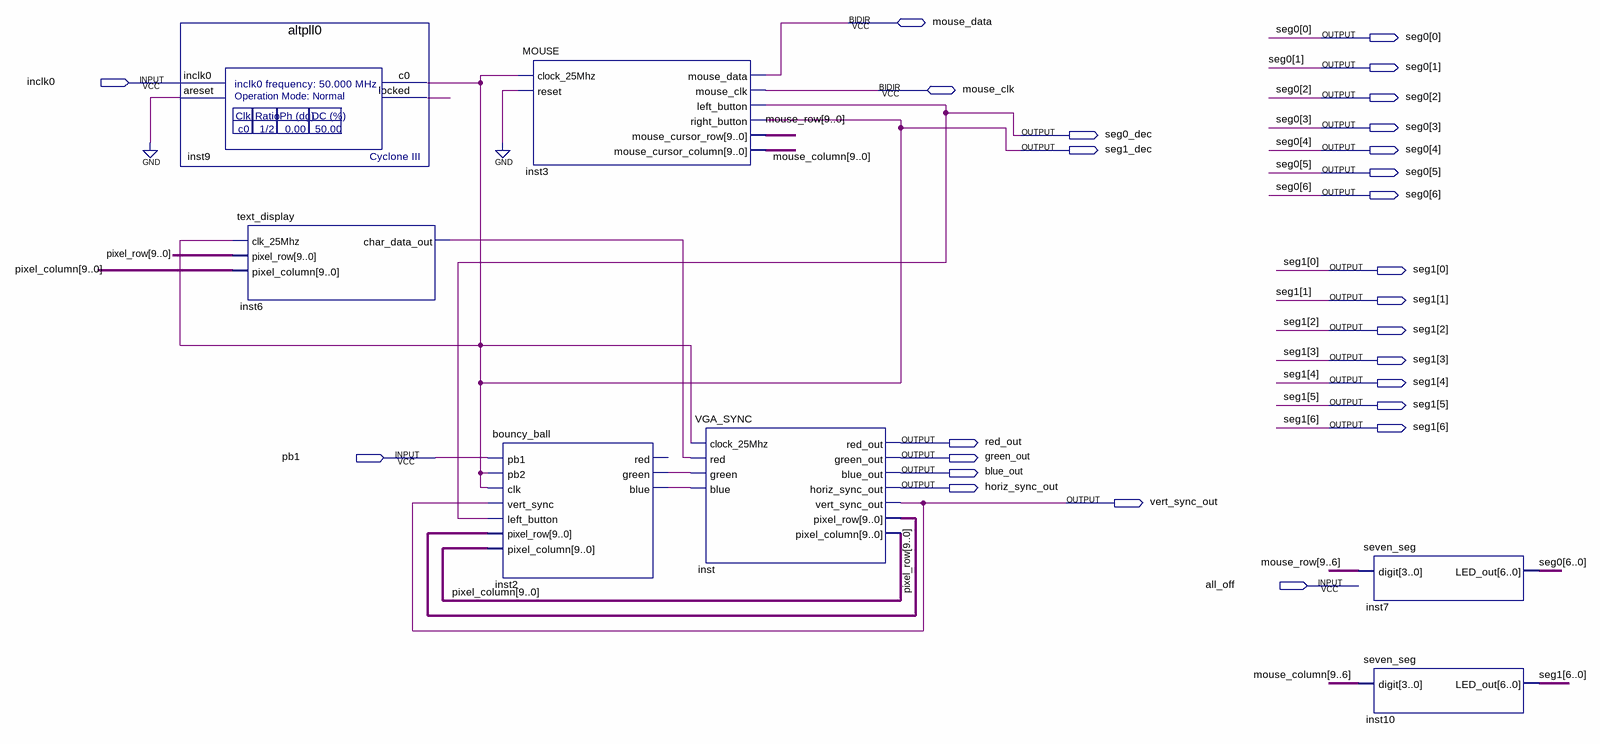
[diagram p0: schematic sheet]
// Quartus schematic MouseExample.bdf as structural Verilog: 7 symbols, 26 pins
module MouseExample (
  input  inclk0,
  input  pb1,
  input  all_off,
  inout  mouse_data,
  inout  mouse_clk,
  output [6:0] seg0,
  output seg0_dec,
  output seg1_dec,
  output [6:0] seg1,
  output red_out,
  output green_out,
  output blue_out,
  output horiz_sync_out,
  output vert_sync_out
);

  wire inst2_blue, inst2_green, inst6_char_data_out, inst9_locked;
  wire [9:0] mouse_column, mouse_row, pixel_column, pixel_row;

  altpll0 inst9 (.inclk0(inclk0), .areset(1'b0), .c0(seg1_dec), .locked(inst9_locked));
  text_display inst6 (
    .clk_25Mhz(seg1_dec), .pixel_row(pixel_row), .pixel_column(pixel_column),
    .char_data_out(inst6_char_data_out));
  MOUSE inst3 (
    .clock_25Mhz(seg1_dec), .reset(1'b0), .left_button(seg0_dec), .right_button(seg1_dec),
    .mouse_cursor_row(mouse_row), .mouse_cursor_column(mouse_column), .mouse_data(mouse_data),
    .mouse_clk(mouse_clk));
  bouncy_ball inst2 (
    .pb1(pb1), .pb2(seg1_dec), .clk(seg1_dec), .vert_sync(vert_sync_out), .left_button(seg0_dec),
    .pixel_row(pixel_row), .pixel_column(pixel_column), .green(inst2_green), .blue(inst2_blue));  // open: red
  VGA_SYNC inst (
    .clock_25Mhz(seg1_dec), .red(inst6_char_data_out), .green(inst2_green), .blue(inst2_blue),
    .red_out(red_out), .green_out(green_out), .blue_out(blue_out), .horiz_sync_out(horiz_sync_out),
    .vert_sync_out(vert_sync_out), .pixel_row(pixel_row), .pixel_column(pixel_column));
  seven_seg inst7 (.digit(mouse_row[9:6]), .LED_out(seg0));
  seven_seg inst10 (.digit(mouse_column[9:6]), .LED_out(seg1));
endmodule
